# EAGLE design DC_Motorsteuerung_Piggyboard (EAGLE 6.2)
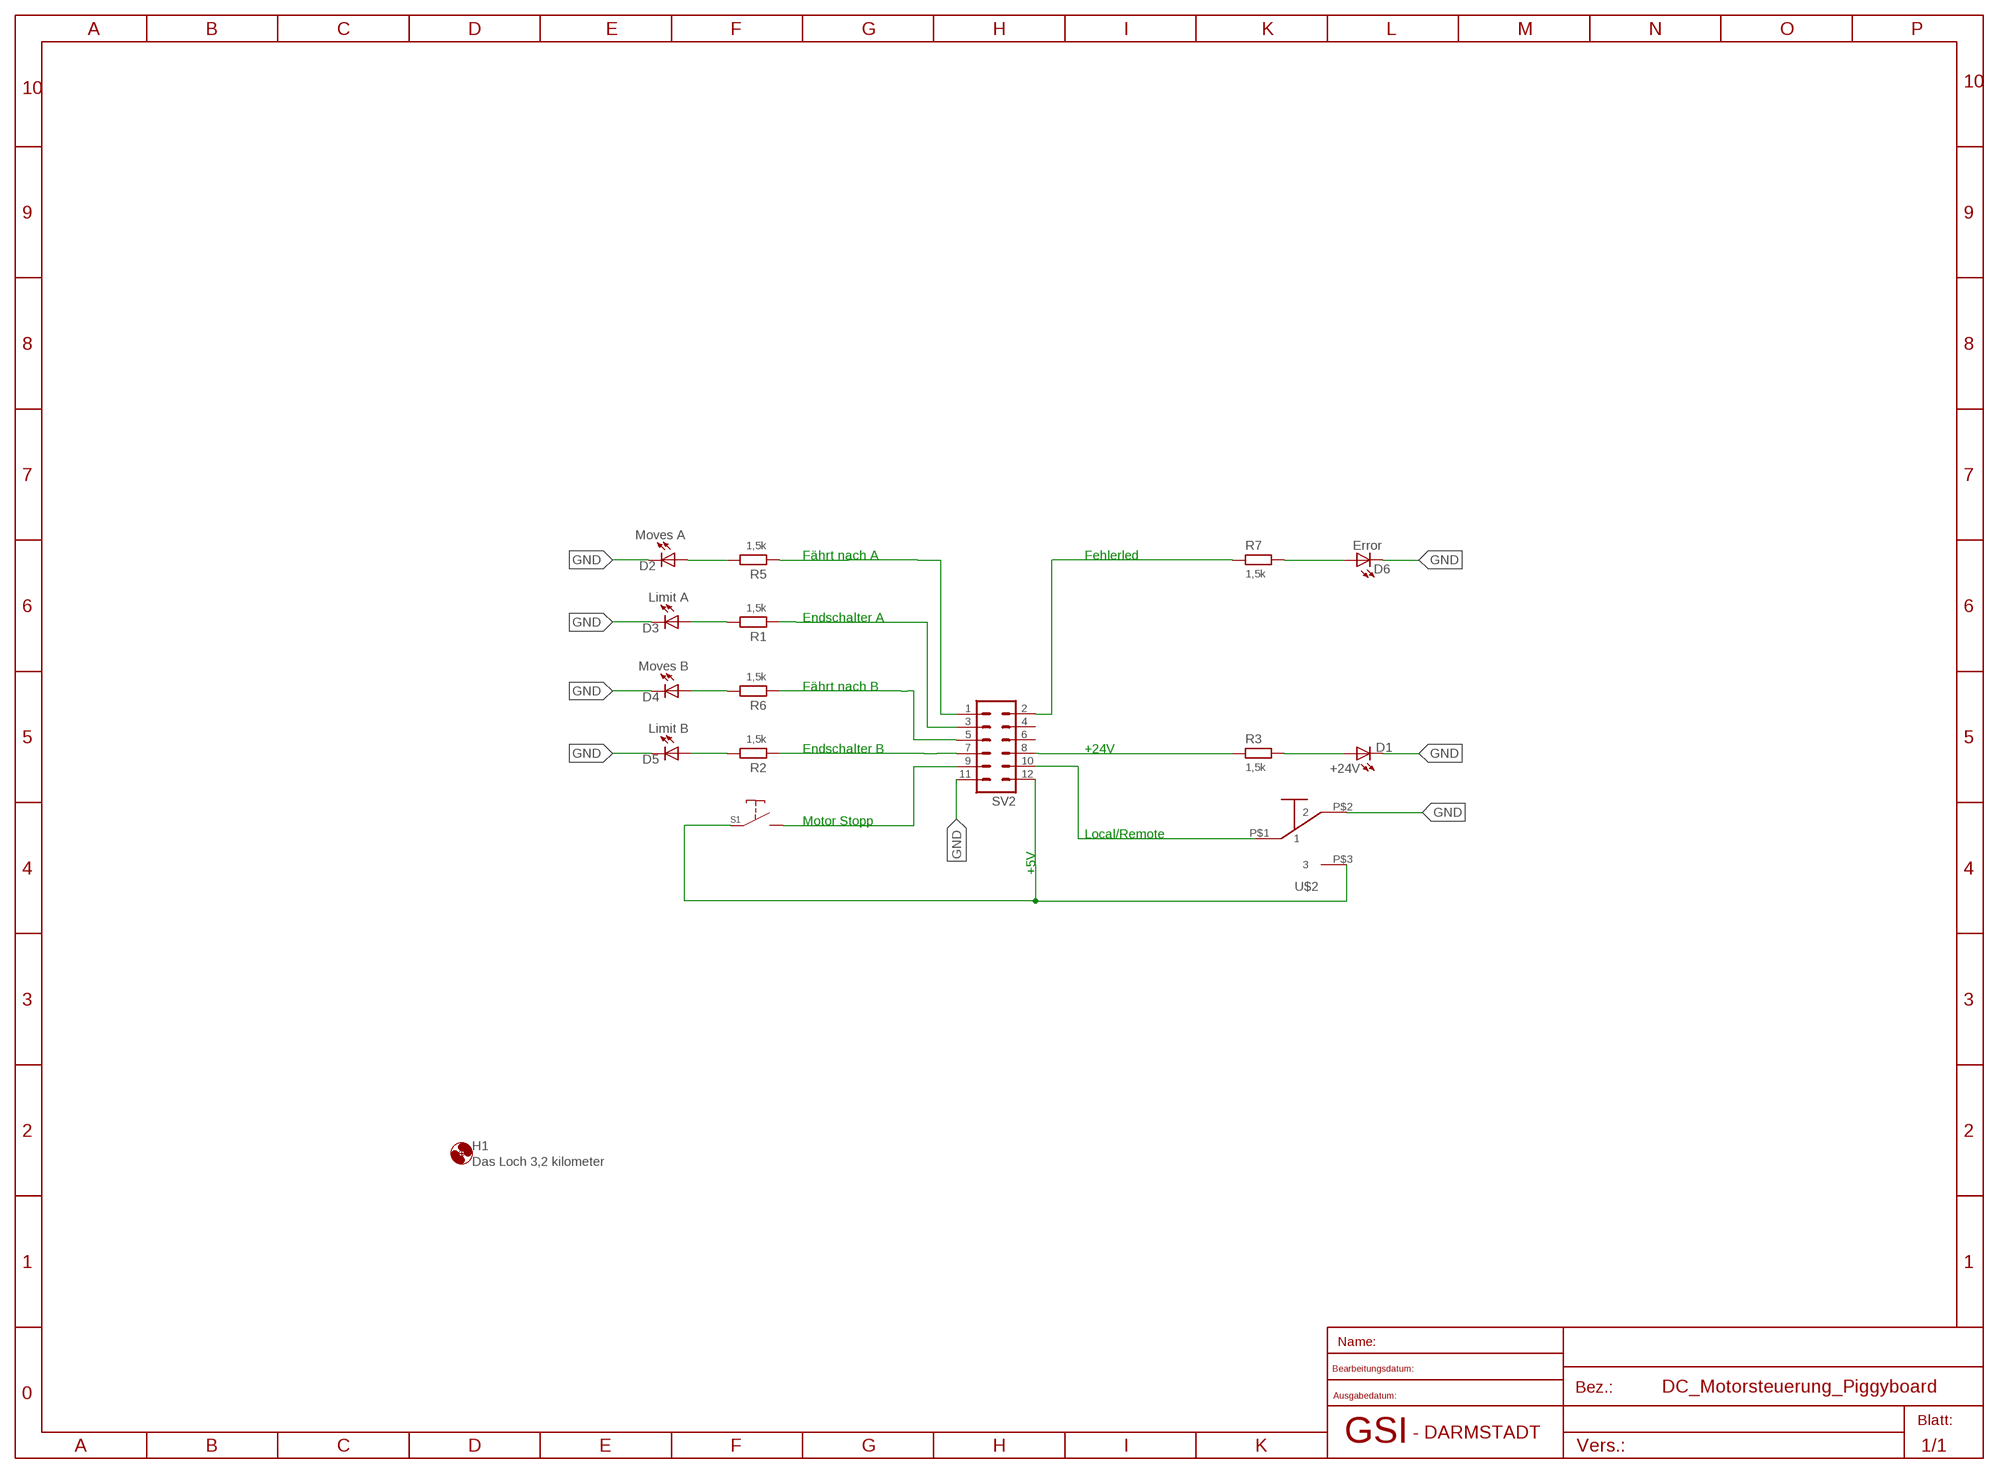
[diagram p0: schematic, sheet 1]

## Parts
D1  +24V  LED3MM  [LED3MMCASE]
D2  Moves A  LED3MM  [LED3MMCASE]
D3  Limit A  LED3MM  [LED3MMCASE]
D4  Moves B  LED3MM  [LED3MMCASE]
D5  Limit B  LED3MM  [LED3MMCASE]
D6  Error  LED3MM  [LED3MMCASE]
H1  Das Loch 3,2 kilometer  MOUNT-HOLE3.2  [3,2]
R1  1,5k  R_0,4W  [R_0,4W]
R2  1,5k  R_0,4W  [R_0,4W]
R3  1,5k  R_0,4W  [R_0,4W]
R5  1,5k  R_0,4W  [R_0,4W]
R6  1,5k  R_0,4W  [R_0,4W]
R7  1,5k  R_0,4W  [R_0,4W]
S1  MotorStopp  DRUCKTASTER_ABGW  [1_POL_ABGW]
SV2  MA06-2  [MA06-2]
U$2  UMSCHALTER_SINGLE_POLE  [UMSCHALTER_SINGLE_POLE]

## Nets
GND: D1.P$2(C) D2.P$2(C) D3.P$2(C) D4.P$2(C) D5.P$2(C) D6.P$2(C) SV2.11 U$2.P$2
N$1: R2.1 SV2.7
N$2: D3.P$1(A) R1.2
N$3: R1.1 SV2.3
N$4: D5.P$1(A) R2.2
N$5: D6.P$1(A) R7.2
N$6: R3.1 SV2.8
N$7: S1.S2(N0) SV2.9
N$9: SV2.10 U$2.P$1
N$10: D4.P$1(A) R6.2
N$11: S1.S1(C) SV2.12 U$2.P$3
N$12: R5.1 SV2.1
N$13: D1.P$1(A) R3.2
N$14: D2.P$1(A) R5.2
N$15: R7.1 SV2.2
N$20: R6.1 SV2.5
Unconnected: SV2.4 SV2.6

## Notes on the sheet
- Fährt nach A | Fehlerled
- Endschalter A
- Fährt nach B
- Endschalter B | +24V
- Motor Stopp
- Local/Remote
- +5V

## Library data of the parts
D1-D6 = Test:LED3MM: LED 3mm mit Gehäuse 3 mm LED 2V / 5mA Gehäuse 10x4mm Einfach Gehäuse < h5> Gehäuse bei Conrad erhältlich --> http://www.conrad.de/ce/de/product/184438/LED-Kunststoffhalter-B26325000-Passend-fuer-LED-3-mm <URL> LED im Lagerkatalog erhältlich: grün Lagernr. 1714 --> http://www-alt.gsi.de/informationen/internal/sap/ora/lkat2.php?tx1=leuchtdiode+gr%FCn&wagru=alle <URL> rot Lagernr. 1712 --> http://www-alt.gsi.de/informationen/internal/sap/ora/lkat2.php?tx1=1712&wagru=alle <URL>
H1 = Holes:MOUNT-HOLE: MOUNTING HOLE with drill center marker
R1-R3 R5-R7 = Resistor:R_0,4W: Resistor 0,4 W
S1 = Switch:DRUCKTASTER
SV2 = con-lstb:MA06-2: PIN HEADER; OC_FARNELL: unknown; OC_NEWARK: unknown
U$2 = Test:UMSCHALTER_SINGLE_POLE

## Board
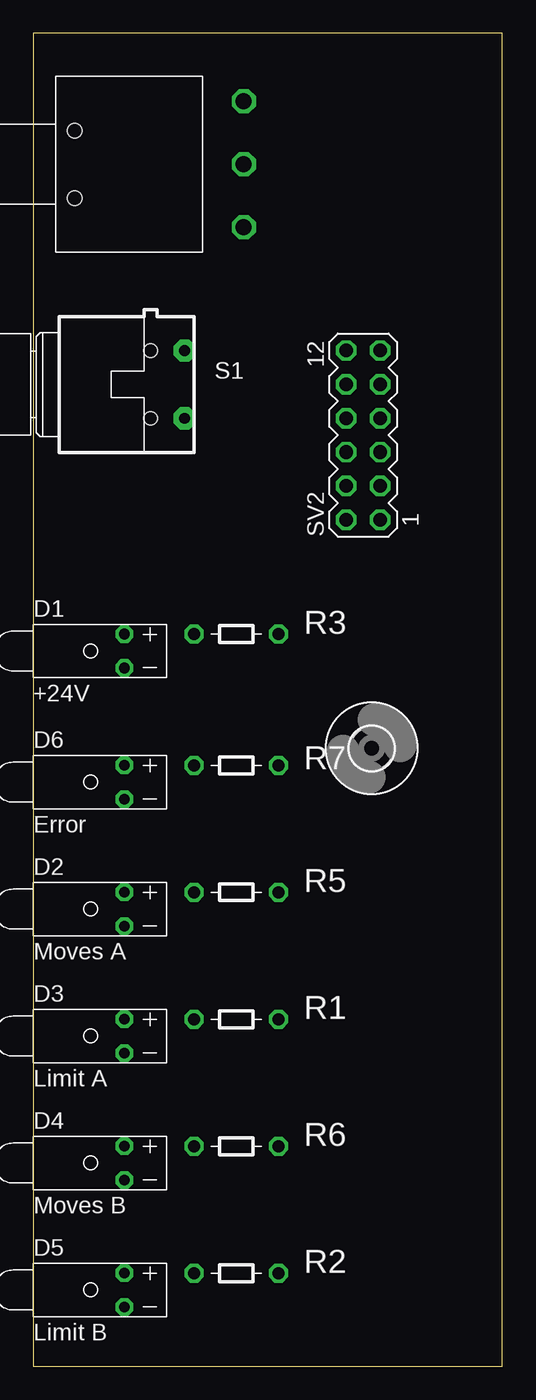
[diagram p1: board, top side]
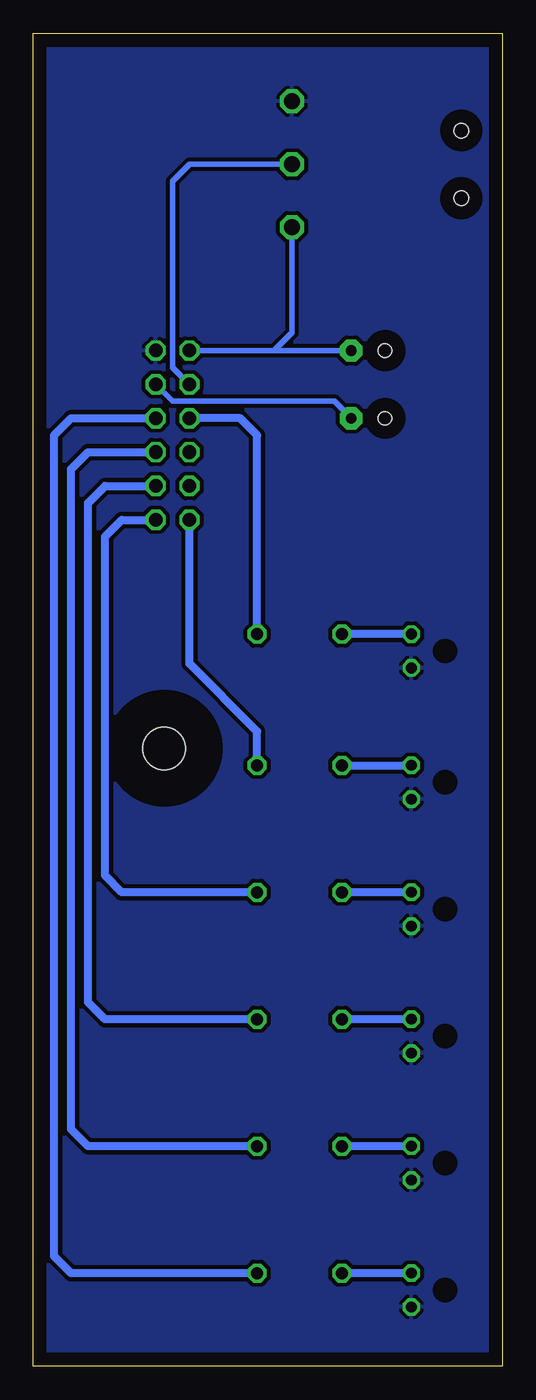
[diagram p2: board, bottom side, seen from below]

Size 35.22 x 100 mm. Coordinates in mm from the lower left corner, seen from the top.
Outline: 0,0 35.22,0 35.22,100 0,100 0,0
Copper layers (1+16): Top 0.035mm / dielectric 1.5mm / Bottom 0.035mm
Design rules: minimum track width 0.304mm, minimum drill 0.3mm, track to track 10mil, track to pad 10mil, pad to pad 10mil, via to via 10mil, smd to smd 8mil, copper to edge 40mil, drill to drill 20mil, minimum pad ring 10mil, minimum via ring 8mil, stop-mask expansion 4mil, vias tented up to drill 0mil, thermal gap 10mil

### Footprints (pad centres in the part's own frame; a part is rotated, then mirrored left to right if it is on the bottom)
LED3MMCASE = drill 0.8 octagon: P$1 6.84,1.27; P$2 6.84,-1.27
3,2 = hole 3.2: 0,0
R_0,4W = drill 0.9 pad 1.422 octagon: 1 -3.81,0; 2 2.54,0
1_POL_ABGW = drill 0.8 pad 1.676 octagon: S1 6.35,2.54; S2 6.35,-2.54 | hole 1.016: 3.81,-2.54; 3.81,2.54
MA06-2 = drill 1.016 octagon: 1 -6.35,-1.27; 2 -6.35,1.27; 3 -3.81,-1.27; 4 -3.81,1.27; 5 -1.27,-1.27; 6 -1.27,1.27; 7 1.27,-1.27; 8 1.27,1.27; 9 3.81,-1.27; 10 3.81,1.27; 11 6.35,-1.27; 12 6.35,1.27
UMSCHALTER_SINGLE_POLE = drill 1.2 octagon: P$1 3.1,0; P$2 3.1,4.72; P$3 3.1,-4.7 | hole 1.1: -9.6,2.54; -9.6,-2.54

### Placement (x,y rotation side)
D1  0,53.66 0 top
D2  0,34.29 0 top
D3  0,24.77 0 top
D4  0,15.24 0 top
D5  0,5.71 0 top
D6  0,43.81 0 top
H1  25.4,46.35 0 top
R1  14.61,26.04 180 top
R2  14.61,6.99 180 top
R3  14.61,54.93 180 top
R5  14.61,35.56 180 top
R6  14.61,16.51 180 top
R7  14.61,45.09 180 top
S1  5.01,73.65 0 top
SV2  24.77,69.85 90 top
U$2  12.7,90.17 0 top

### Tracks (layer width: path | path; a pad name or v marks a point on that pad's centre or on a via)
GND
  pour Bottom (isolate 0.305): 0,0 35.24,0 35.24,100.01 0,100.01
N$1
  Bottom 0.61: R2.1 32.38,6.99 33.66,8.26 33.66,69.85 32.38,71.12 SV2.7
N$2
  Bottom 0.61: D3.P$1 R1.2
N$3
  Bottom 0.61: R1.1 29.84,26.04 31.11,27.3 31.11,64.77 29.84,66.04 SV2.3
N$4
  Bottom 0.61: D5.P$1 R2.2
N$5
  Bottom 0.61: R7.2 D6.P$1
N$6
  Bottom 0.61: R3.1 18.41,69.85 19.68,71.12 SV2.8
N$7
  Bottom 0.406: SV2.9 24.77,72.39 12.63,72.39 | 12.7,72.39 12.63,72.39 | 12.63,72.39 S1.S2
N$9
  Bottom 0.406: SV2.10 24.77,74.93 24.77,88.9 23.5,90.17 U$2.P$1
N$10
  Bottom 0.61: D4.P$1 R6.2
N$11
  Bottom 0.406: SV2.12 17.14,76.2 | 17.14,76.2 12.7,76.2 S1.S1 | U$2.P$3 15.8,77.55 17.14,76.2
N$12
  Bottom 0.61: R5.1 28.57,35.56 29.84,36.83 29.84,62.23 28.57,63.5 SV2.1
N$13
  Bottom 0.61: D1.P$1 R3.2
N$14
  Bottom 0.61: D2.P$1 R5.2
N$15
  Bottom 0.61: R7.1 18.41,47.62 23.5,52.7 SV2.2
N$20
  Bottom 0.61: R6.1 31.11,16.51 32.38,17.78 32.38,67.31 31.11,68.58 SV2.5